# Altium project Humidity_Fan_Control_V3.PrjPcb
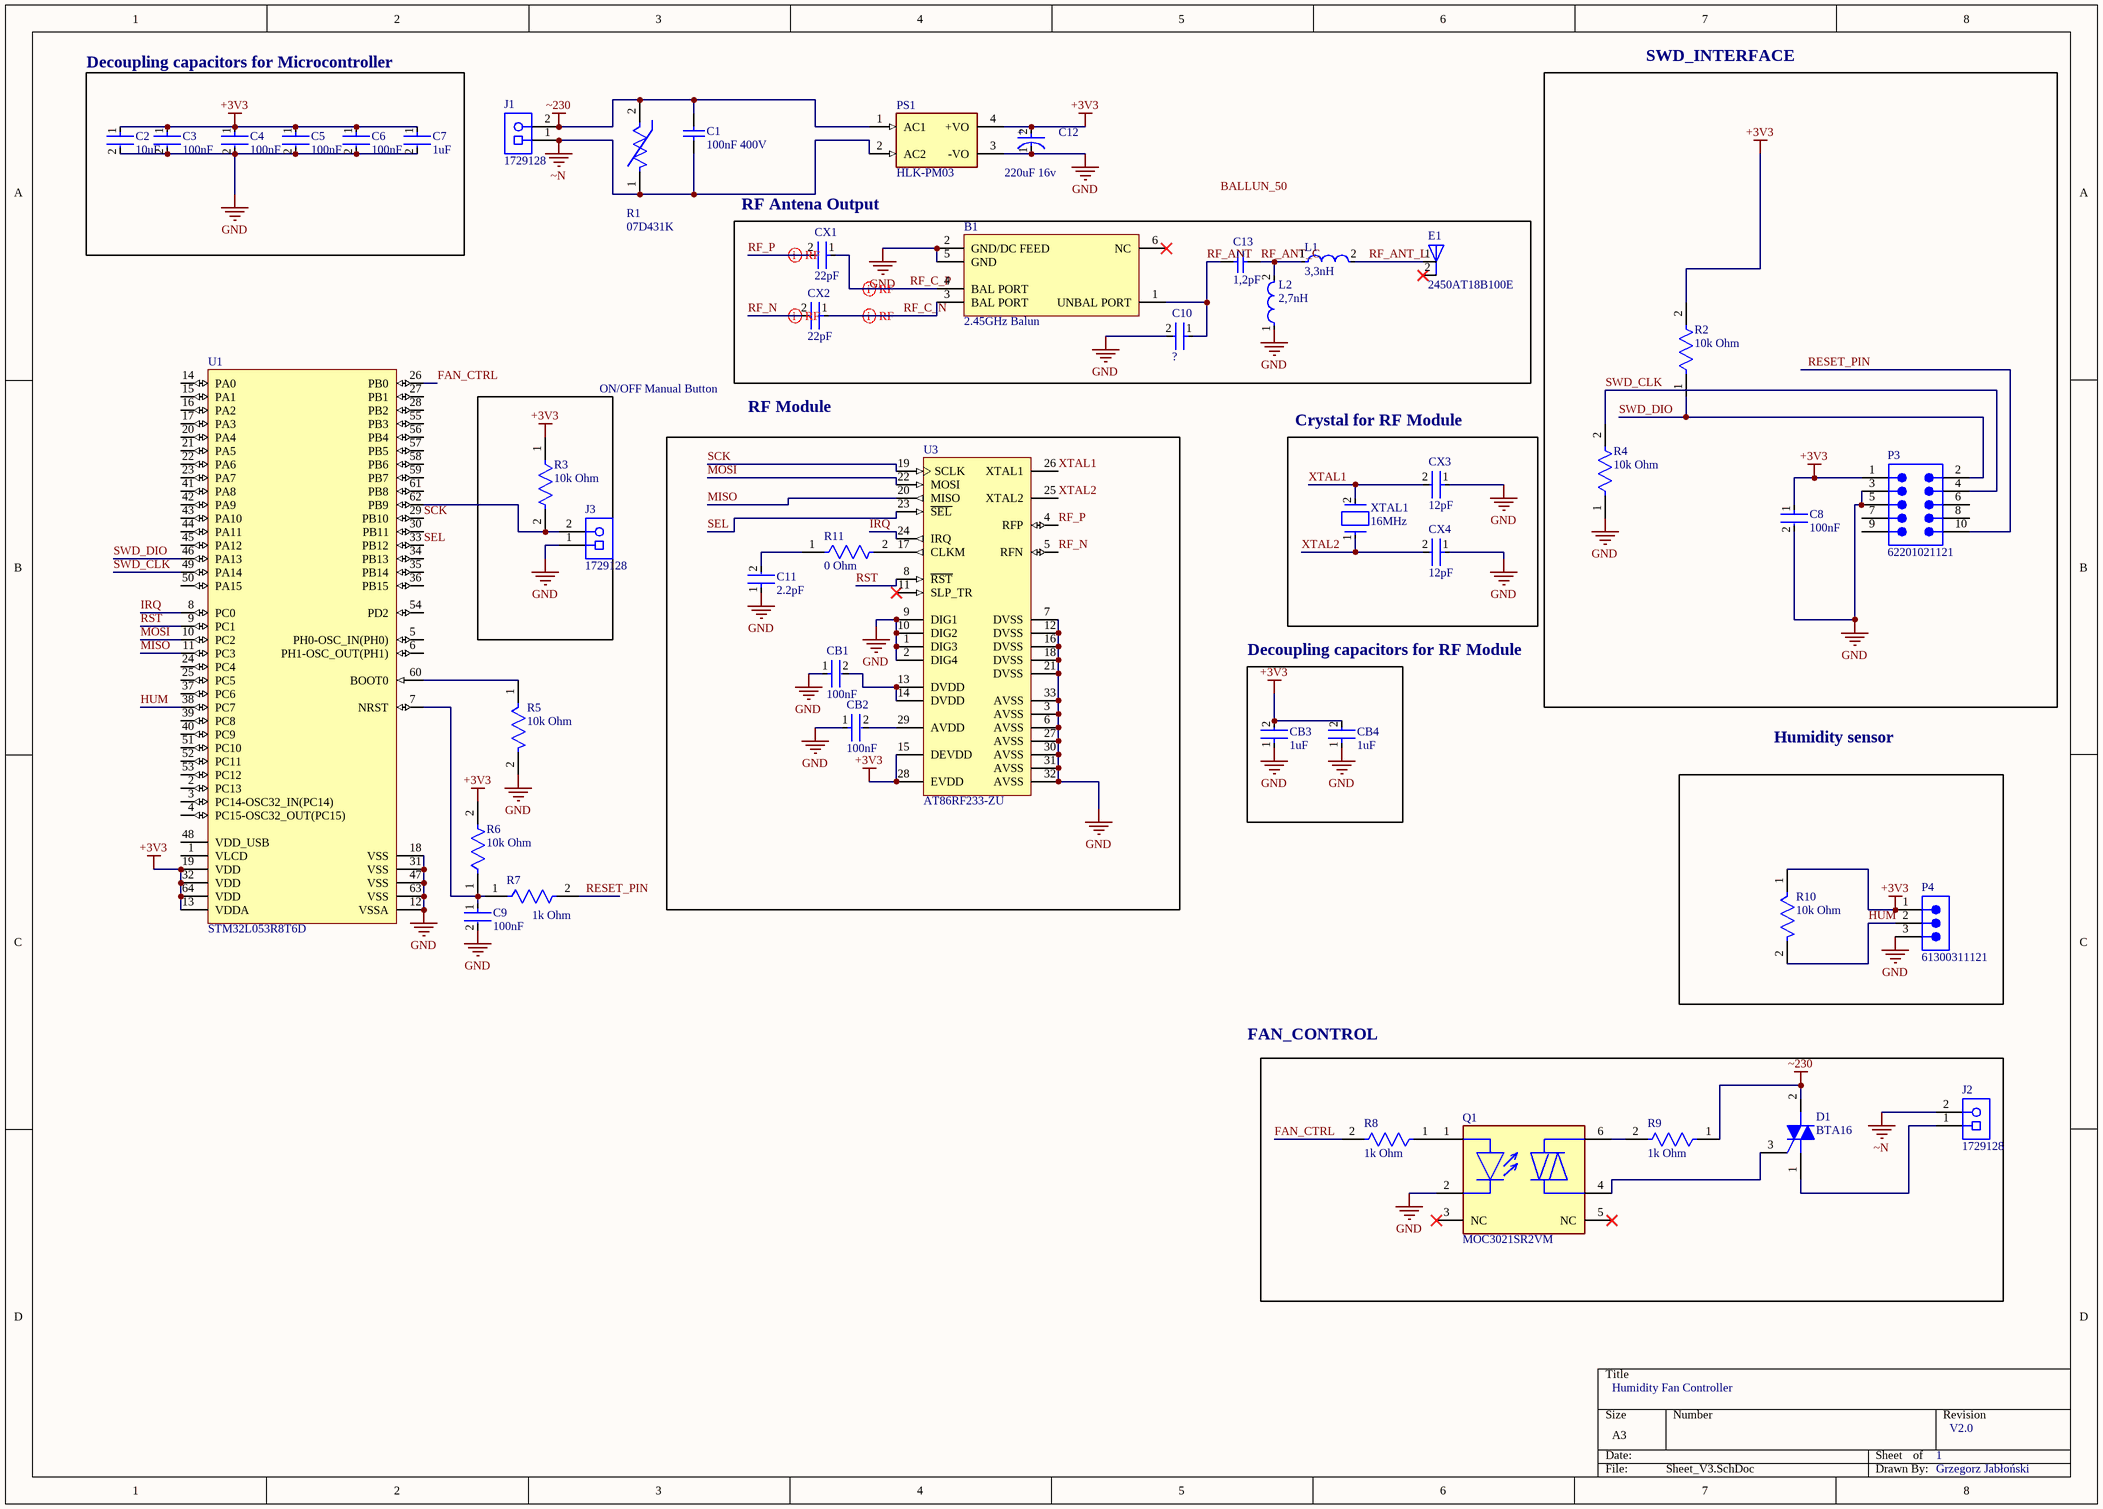
[diagram p0: Sheet_V3.SchDoc]
1 sheet, 47 parts. Net scope: global (net labels, ports and power ports of the same name join across sheets).
Board file: PCB_V3.PcbDoc

## Sheet Sheet_V3.SchDoc: Humidity Fan Controller
size A3; Author: Grzegorz Jabłoński; Revision: V2.0; SheetNumber: 1; SheetTotal: 1

### Parts
B1  2.45GHz Balun  [WE-BAL_0805]
C1  100nF 400V  [TDK-B32921C3104M]
C2  10uF  [FP-CC0805-0_85-MFG]
C3  100nF  [FP-CC0805-0_85-MFG]
C4  100nF  [FP-CC0805-0_85-MFG]
C5  100nF  [FP-CC0805-0_85-MFG]
C6  100nF  [FP-CC0805-0_85-MFG]
C7  1uF  [FP-CC0805-0_85-MFG]
C8  100nF  [FP-CC0805-0_85-MFG]
C9  100nF  [FP-CC0805-0_85-MFG]
C10  ?  [FP-CC0805-0_85-MFG]
C11  2.2pF  [FP-CC0805-0_85-MFG]
C12  220uF 16v  [FP-OS-CON-TH-E13-d_0_6-MFG]
C13  1,2pF  [CAPC1005X56X25NL10T15]
CB1  100nF  [FP-CC0805-0_85-MFG]
CB2  100nF  [FP-CC0805-0_85-MFG]
CB3  1uF  [FP-CC0805-0_85-MFG]
CB4  1uF  [FP-CC0805-0_85-MFG]
CX1  22pF  [FP-CC0805-0_85-MFG]
CX2  22pF  [FP-CC0805-0_85-MFG]
CX3  12pF  [FP-CC0805-0_85-MFG]
CX4  12pF  [FP-CC0805-0_85-MFG]
D1  BTA16  [ONSC-TO-220-3-221A-09]
E1  2450AT18B100E  [XDCR_2450AT18B100E]
J1  1729128  [PHOE-1729128-2_V]
J2  1729128  [PHOE-1729128-2_V]
J3  1729128  [PHOE-1729128-2_V]
L1  3,3nH  [FP-L-07-MFG]
L2  2,7nH  [FP-L-07-MFG]
P3  62201021121  [62201021121]
P4  61300311121  [61300311121]
PS1  HLK-PM03  [CONV_HLK-PM03]
Q1  MOC3021SR2VM  [FP-646BY-MFG]
R1  07D431K  [FP-B72207S0110K101-MFG]
R2  10k Ohm  [FP-RMCF0805-MFG]
R3  10k Ohm  [FP-RMCF0805-MFG]
R4  10k Ohm  [FP-RMCF0805-MFG]
R5  10k Ohm  [FP-RMCF0805-MFG]
R6  10k Ohm  [FP-RMCF0805-MFG]
R7  1k Ohm  [FP-RMCF0805-MFG]
R8  1k Ohm  [FP-RMCF0805-MFG]
R9  1k Ohm  [FP-RMCF0805-MFG]
R10  10k Ohm  [FP-RMCF0805-MFG]
R11  0 Ohm  [FP-RMCF0805-MFG]
U1  STM32L053R8T6D  [STM-LQFP64_L]
U3  AT86RF233-ZU  [32QN2_M]
XTAL1  16MHz  [FP-ABLS-MFG]

### Blocks framed on the sheet
Decoupling capacitors for Microcontroller: C2-C7
SWD_INTERFACE: C8 P3 R2 R4
RF Antena Output: B1 C10 C13 CX1 CX2 E1 L1 L2
ON/OFF Manual Button: J3 R3
Crystal for RF Module: CX3 CX4 XTAL1
Decoupling capacitors for RF Module: CB3 CB4

### Nets
+3V3: C2.1 C3.1 C4.1 C5.1 C6.1 C7.1 C8.1 C12.2(A) CB3.2 CB4.2 P3.1 P4.1 PS1.4(+VO) R2.2 R3.1 R6.2 R10.1 U1.13(VDDA) U1.19(VDD) U1.32(VDD) U1.64(VDD) U3.15(DEVDD) U3.28(EVDD)
GND: B1.2(GND/DC_FEED) B1.5(GND) C2.2 C3.2 C4.2 C5.2 C6.2 C7.2 C8.2 C9.2 C10.2 C11.1 C12.1(C) CB1.1 CB2.1 CB3.1 CB4.1 CX3.1 CX4.1 J3.1 L2.1 P3.3 P3.5 P4.3 PS1.3(-VO) Q1.2(C) R4.1 R5.2 U1.12(VSSA) U1.18(VSS) U1.31(VSS) U1.47(VSS) U1.63(VSS) U3.1(DIG3) U3.2(DIG4) U3.3(AVSS) U3.6(AVSS) U3.7(DVSS) U3.9(DIG1) U3.10(DIG2) U3.12(DVSS) U3.16(DVSS) U3.18(DVSS) U3.21(DVSS) U3.27(AVSS) U3.30(AVSS) U3.31(AVSS) U3.32(AVSS) U3.33(AVSS)
~230: C1.2 D1.2(MT2) J1.2 PS1.1(AC1) R1.2 R9.1
~N: C1.1 J1.1 J2.2 PS1.2(AC2) R1.1
FAN_CTRL: R8.2 U1.26(PB0)
HUM: P4.2 R10.2 U1.38(PC7)
IRQ: U1.8(PC0) U3.24(IRQ)
MISO: U1.11(PC3) U3.20(MISO)
MOSI: U1.10(PC2) U3.22(MOSI)
RESET_PIN: P3.10 R7.2
RF_ANT: B1.1(UNBAL_PORT) C10.1 C13.1
RF_ANT_C: C13.2 L1.1 L2.2
RF_ANT_L: E1.1(FEED) L1.2
RF_C_N: B1.3(BAL_PORT) CX2.1
RF_C_P: B1.4(BAL_PORT) CX1.1
RF_N: CX2.2 U3.5(RFN)
RF_P: CX1.2 U3.4(RFP)
RST: U1.9(PC1) U3.8(~{RST})
SCK: U1.29(PB10) U3.19(SCLK)
SEL: U1.33(PB12) U3.23(~{SEL})
SWD_CLK: P3.4 R4.2 U1.49(PA14)
SWD_DIO: P3.2 R2.1 U1.46(PA13)
XTAL1: CX3.2 U3.26(XTAL1) XTAL1.2
XTAL2: CX4.2 U3.25(XTAL2) XTAL1.1
NetC9_1: C9.1 R6.1 R7.1 U1.7(NRST)
NetC11_2: C11.2 R11.1
NetCB1_2: CB1.2 U3.13(DVDD) U3.14(DVDD)
NetCB2_2: CB2.2 U3.29(AVDD)
NetD1_1: D1.1(MT1) J2.1
NetD1_3: D1.3(G) Q1.4(1_MAIN_TERM)
NetJ3_2: J3.2 R3.2 U1.62(PB9)
NetQ1_1: Q1.1(A) R8.1
NetQ1_6: Q1.6(2_MAIN_TERM) R9.2
NetR5_1: R5.1 U1.60(BOOT0)
NetR11_2: R11.2 U3.17(CLKM)

Not connected (* = marked no-connect by the designer): B1 6(NC)*; E1 2(NC)*; P3 6 7 8 9; Q1 3(NC)* 5(NC)*; U1 1(VLCD) 2(PC13) 3(PC14-OSC32_IN(PC14)) 4(PC15-OSC32_OUT(PC15)) 5(PH0-OSC_IN(PH0)) 6(PH1-OSC_OUT(PH1)) 14(PA0) 15(PA1) 16(PA2) 17(PA3) 20(PA4) 21(PA5) 22(PA6) 23(PA7) 24(PC4) 25(PC5) 27(PB1) 28(PB2) 30(PB11) 34(PB13) 35(PB14) 36(PB15) 37(PC6) 39(PC8) 40(PC9) 41(PA8) 42(PA9) 43(PA10) 44(PA11) 45(PA12) 48(VDD_USB) 50(PA15) 51(PC10) 52(PC11) 53(PC12) 54(PD2) 55(PB3) 56(PB4) 57(PB5) 58(PB6) 59(PB7) 61(PB8); U3 11(SLP_TR)*

### Layout directives
differential pair; differential pair class RF: RF_C_N, RF_C_P, RF_N, RF_P

### Notes on the sheet
- RF Module
- Humidity sensor
- FAN_CONTROL
- Labels drawn without touching a wire or pin: BALLUN_50
- (in symbol CMP-05428-000279-1) +

### Library data of the parts
B1 = CMP-03913-19122360-1: 748421245 100O Surface Mount Chip Balun; Insertion Loss (dB): 0.54dB; Impedance: 100Ω; Frequency: 2.5GHz; Depth: 850µm; Case Code (Metric): 2012; Height: 850µm; Max Operating Temperature: 85°C; Length: 2mm; Width: 1.25mm; Termination: SMD/SMT; Case Code (Imperial): 0805; Number of Pins: 6; RoHS: Compliant; Max Switching Frequency: 2.5GHz; NexarPartId: 19122360; REACH SVHC: Unknown; Case/Package: 0805; Min Operating Temperature: -40°C; Lead Free: Lead Free; Mount: Surface Mount; Max Frequency: 2.5GHz; Packaging: Cut Tape (CT)
C1 = CMP-2000-05890-1: EMI Suppression Capacitor (MKP), 0.1 uF, +/- 20%, 305 V, 2-Pin THD, RoHS, Bulk; Manufacturer: TDK; PCN Packaging: MKT,MKPTypeLaserMarking26/Apr/2013; Online Catalog: B32921C/D-B32928C/DSeries; Featured Product: FilmCapacitors; Product Training Modules: FilmCapacitorsCapacitorsforLEDApplicationsAutomotiveIndustryCapacitors; Catalog Drawings: Y(1,2),X(1,2)SeriesSide1Y(1,2),X(1,2)SeriesSide2; PCN Design/Specification: B32(5679)B333Series02/May/2014; Other Names: 495-2318B32921C3104M000B32921C3104MN1; Capacitance: 0.1µF; Voltage Rating - AC: 305V; Dielectric Material: Polypropylene(PP); Datasheet URL: https://en.tdk.eu/inf/20/20/db/fc_2009/X2_B32921_928.pdf; Package / Case: Radial; Operating Temperature: -40°C~110°C; Lead Spacing: 0.394"(10.00mm); Size / Dimension: 0.512"Lx0.236"W(13.00mmx6.00mm); Package Reference: B32921C3104M; Datasheet Version: 09/2016; Features: X2SafetyRated; Standard Package: 1,000; Category: Capacitors; Package Description: 2-Pin Through Hole Device, Body 13 x 6 mm, Pitch 10 mm; Family: FilmCapacitors; ESR (Equivalent Series Resistance): -; Voltage Rating - DC: -; Termination: PCPins; Packaging: Bulk; Mounting Type: ThroughHole; Height - Seated (Max): 0.472"(12.00mm); Mounting Technology: ThroughHole; Manufacturer URL: http://www.tdk.com/; Applications: EMI,RFISuppression; Tolerance: ±20%; Series: B32921
C2 C7 C10 C11 = CMP-2100-03606-3: CAP CER 0.1UF 50V X7R 0805; Manufacturer Part Number: CC0805KRX7R9BB104; Manufacturer: Yageo; Tolerance: 0.1; Capacitance: 100 nF; Value: 100 nF; Material: Ceramic; Device Class L1: Passive Components; ComponentLink2Description: Datasheet; Package: CC0805-0.85; Digikey Description: CAP CER 0.1UF 50V X7R 0805; Device Class L3: Ceramic Capacitors; Temperature: -30°C to +85°C; Temperature Characteristic: X7R; Voltage Rating: 50 V; Height: 0.95mm; RoHS: TRUE; Ipc Land Pattern Name: CAPC200125X85; Device Class L2: Capacitors; Category: Cap; Temperature Range Low: -30°C; Temperature Range High: +85°C; Mouser Description: Multilayer Ceramic Capacitors MLCC - SMD/SMT 100nF 50V X7R 10%; Footprint Url: http://www.yageo.com/exep/pages/download/literatures/UPY-C_GEN_24.pdf; Automotive: No; Octopart: https://octopart.com/cc0805krx7r9bb104-yageo-192993; Lead Free: Yes; ComponentLink2URL: http://www.yageo.com/documents/recent/UPY-GPHC_Y5V_6.3V-to-50V_8.pdf
C3-C6 C8 C9 = CMP-2100-03606-3: CAP CER 0.1UF 50V X7R 0805; Manufacturer Part Number: CC0805KRX7R9BB104; Manufacturer: Yageo; Tolerance: 0.1; Material: Ceramic; Device Class L1: Passive Components; ComponentLink2Description: Datasheet; Package: CC0805-0.85; Digikey Description: CAP CER 0.1UF 50V X7R 0805; Capacitance: 100 nF; Device Class L3: Ceramic Capacitors; Value: 100 nF; Temperature: -30°C to +85°C; Temperature Characteristic: X7R; Voltage Rating: 50 V; Height: 0.95mm; RoHS: TRUE; Ipc Land Pattern Name: CAPC200125X85; Device Class L2: Capacitors; Category: Cap; Temperature Range Low: -30°C; Temperature Range High: +85°C; Mouser Description: Multilayer Ceramic Capacitors MLCC - SMD/SMT 100nF 50V X7R 10%; Footprint Url: http://www.yageo.com/exep/pages/download/literatures/UPY-C_GEN_24.pdf; Automotive: No; Octopart: https://octopart.com/cc0805krx7r9bb104-yageo-192993; Lead Free: Yes; ComponentLink2URL: http://www.yageo.com/documents/recent/UPY-GPHC_Y5V_6.3V-to-50V_8.pdf
C12 = CMP-05428-000279-1: Conductive Polymer Aluminum Solid Capacitors (OS-CON) 560uF ±20% 16V RADIAL TH 8x13mm; ESR (Equivalent Series Resistance): 8mR; Case/Package: Radial; Tolerance: 20%; Min Operating Temperature: -55°C; Max Operating Temperature: 105°C; Packaging: Bulk; Series: OS-CON™, SEPG; Mount: Through Hole; Capacitance: 560uF; RoHS Compliant: Yes; Voltage Rating: 16V
C13 = CMP-2008-02540-1: Manufacturer: AVX Interconnect / Elco; Part Number: 04023C561KAT2A
CB1 CB2 = CMP-2100-03606-3: CAP CER 0.1UF 50V X7R 0805; Manufacturer Part Number: CC0805KRX7R9BB104; Manufacturer: Yageo; Tolerance: 0.1; Device Class L1: Passive Components; ComponentLink2Description: Datasheet; Package: CC0805-0.85; Digikey Description: CAP CER 0.1UF 50V X7R 0805; Capacitance: 100 nF; Device Class L3: Ceramic Capacitors; Value: 100 nF; Temperature: -30°C to +85°C; Temperature Characteristic: X7R; Voltage Rating: 50 V; Height: 0.95mm; RoHS: TRUE; Ipc Land Pattern Name: CAPC200125X85; Device Class L2: Capacitors; Category: Cap; Temperature Range Low: -30°C; Temperature Range High: +85°C; Material: Ceramic; Mouser Description: Multilayer Ceramic Capacitors MLCC - SMD/SMT 100nF 50V X7R 10%; Footprint Url: http://www.yageo.com/exep/pages/download/literatures/UPY-C_GEN_24.pdf; Automotive: No; Octopart: https://octopart.com/cc0805krx7r9bb104-yageo-192993; Lead Free: Yes; ComponentLink2URL: http://www.yageo.com/documents/recent/UPY-GPHC_Y5V_6.3V-to-50V_8.pdf
CB3 CB4 CX1-CX4 = CMP-2100-03606-3: CAP CER 0.1UF 50V X7R 0805; Manufacturer Part Number: CC0805KRX7R9BB104; Manufacturer: Yageo; Tolerance: 0.1; Capacitance: 100 nF; Value: 100 nF; Device Class L1: Passive Components; ComponentLink2Description: Datasheet; Package: CC0805-0.85; Digikey Description: CAP CER 0.1UF 50V X7R 0805; Device Class L3: Ceramic Capacitors; Temperature: -30°C to +85°C; Temperature Characteristic: X7R; Voltage Rating: 50 V; Height: 0.95mm; RoHS: TRUE; Ipc Land Pattern Name: CAPC200125X85; Device Class L2: Capacitors; Category: Cap; Temperature Range Low: -30°C; Temperature Range High: +85°C; Material: Ceramic; Mouser Description: Multilayer Ceramic Capacitors MLCC - SMD/SMT 100nF 50V X7R 10%; Footprint Url: http://www.yageo.com/exep/pages/download/literatures/UPY-C_GEN_24.pdf; Automotive: No; Octopart: https://octopart.com/cc0805krx7r9bb104-yageo-192993; Lead Free: Yes; ComponentLink2URL: http://www.yageo.com/documents/recent/UPY-GPHC_Y5V_6.3V-to-50V_8.pdf
D1 = CMP-1070-00099-1: Sensitive Gate Triacs, Silicon Bidirectional Thyristor, 3-Pin TO-220, Pb-Free, Bulk Box; PartNumber: MAC228A6G; Manufacturer: On Semiconductor; ITSM Max (A): 80; IT(RMS) Max (A): 8; DatasheetVersion: Rev. 7; ComponentLink2Description: Datasheet; PackageDescription: 3-Pin Flange Mount, Vertical Straight Lead, Body 9.97 x 4.445 mm, Pitch 2.54 mm; Packing: Bulk Box; ComponentLink3Description: Package Specification; RoHS: Pb-Free; ComponentLink2URL: http://www.onsemi.com/pub_link/Collateral/MAC228A-D.PDF; ComponentLink3URL: http://www.onsemi.com/pub_link/Collateral/221A-09.PDF; ComponentLink1URL: http://www.onsemi.com/; PackageVersion: Rev. AG, 09/2011; PackageReference: TO-220-3-221A-09; ComponentLink1Description: Manufacturer URL; Mounting Technology: Through Hole
E1 = 2450AT18B100E: 2.4GHz - Chip RF Antenna 2.4GHz ~ 2.5GHz 0.5dBi Solder Surface Mount; MF: Johanson Technology; Price: None; Package: None; Purchase-URL: https://pricing.snapeda.com/search/part/2450AT18B100E/?ref=eda; MP: 2450AT18B100E; Availability: In Stock; SnapEDA_Link: https://www.snapeda.com/parts/2450AT18B100E/Johanson+Technology+Inc./view-part/?ref=snap; Check_prices: https://www.snapeda.com/parts/2450AT18B100E/Johanson+Technology+Inc./view-part/?ref=eda; Value: *
J1-J3 = CMP-2000-05815-1: PCB Terminal Block, 13.5 A, 400 V, 2-Pin THD, RoHS, Bulk; Manufacturer: Phoenix Contact; Package Version: 03/2015; No. of Rows: 1; Pitch: 5.08mm; No. of Positions: 2; Voltage Rating: 400V; Current Rating: 13500mA; Manufacturer URL: http://www.phoenixcontact.com/; Datasheet URL: https://datasheet.ciiva.com/16046/1729128-16046181.pdf; RoHS: TRUE; Package URL: https://www.phoenixcontact.com/online/portal/pi/pxc/product_detail_page/!ut/p/b1/3VdJjqNKFDxLH8AFycySyWY2ozFsEPOMMQaDOX1XedGL_1Vdm5YXJleknhSKeBkvI6EA8ncAo3AYoDhBQGco6KN7VURTdemj9us_IEKEZo_YHiPAEWEFmDGOHMORkqKYCORBZxgL7ZoaZYcbFFUZ3fqxSY6GOuxydWUuHqz1ynmMFygu583Bob0Ewr6Sd_l-5m-kAueHiB0jpRwZwe58wwtkpxtMYd_LmGcDRU02dRNEyWt6Y2ti5pSyJ_reIkzIulrqApdnbT11V5jnCKbYNCvhEM1MCpPByat_X379-iThf08CI5GfOPqfBeS3BRoBOdD55AKVv0iLwCMq-2BrzXWSGRH7pUGD9uwXQjiph3xL0DKQwdGa0JImiIOmBNOestqgwTHSSs2oOep-78apyXQBvNi8ZLaFjvjWvcaUEBu0MC6Wbe-d6mB0FAebo2lUWinqYaZs5DAYzV0RP9yitUjnGJ0iI9xhZkT42OCQNUJJhkgWINNQLP2JFP6OpMg3JCVg70jqHT0lvKOnhHf0lPuOnnLf0VPuWx6_dxwUIvwk5WMkT0kLL1mh61l2yZVSzG3pYV_bqo-mj6uMKwKwdnnW8Jh5RTOJzMOA5c-eJDaZQw4mTMPH02PvS_ZAqNVjVTo2WyYLkwH_KU1mmmG5kjRhDqPXLwwVHvVOjCM60-fpXvTDfMGW1PVFVS1r4e4yVDk4ZdNbkUHvqPqQSeian4UD39fNKmachqdJ1NJbyk8rXT9mXTvPk3oE5meulKGgiruPJek-4I9hTT6G8ZLOyRSm2RRVbThERQad5OS28hdt4YW4vG0stgYYzsWsK4_7y6DZMjJSCqri1kyiZR5vD7pwIrNR7QwPHTcLTI5qT7eRlpHrdGiupYlqQDJ7zy_CND8fWWBoLRXxk1RVcXiBQwbTD4Xi7KL-FuO94t9xaqweXzH; PartNumber: 1729128; Package Description: 2-Pin Through Hole Device, Body 8.1 x 10.16 mm, Pitch 5.08 mm; Datasheet Version: 12/2013; Mounting Technology: ThroughHole; Orientation: Horizontal; Package Reference: 1729128-2; Packing: Bulk
L1 L2 = CMP-56493-000002-1: FIXED IND 3.3NH 300MA 190MOHM SM; Shielding: Unshielded; DC Resistance (DCR): 190mR; Core Material: Ceramic; Self Resonant Frequency: 21GHz; Q Factor: 8; Test Frequency: 100MHz; Case Code (Imperial): 0402; Termination: SMD/SMT; Height - Seated (Max): 0.024inch; Depth: 0.6mm; Width: 0.5mm; Current Rating: 300mA; Military Standard: Not; REACH SVHC: No SVHC; Number of Pins: 2; Weight: 2.3E-05oz; Package Quantity: 10000; RoHS Compliant: Yes; Case/Package: 0402; Min Operating Temperature: -40°C; Mount: Surface Mount; Case Code (Metric): 1005; Radiation Hardening: No; Height: 0.5mm; Max Operating Temperature: 100°C; Series: L-07; DC Current: 300mA; Max DC Current: 300mA; Packaging: Cut Tape; Length: 1mm; Inductance: 3.3nH
P3 = CMP-1502-00948-3: NexarPartId: 32855586; Pitch: 1.27mm; Operating Supply Voltage: 100V; Connector Type: Male Pin; Contact Resistance: 20mΩ; Current Rating: 1A; Number of Contacts: 10; Gender: Male; Contact Mating Length: 3.81mm; Max Operating Temperature: 105°C; Mount: Through Hole; Number of Pins: 10; Row Spacing: 1.27mm; Lead Pitch: 1.27mm; REACH SVHC: Unknown; Min Operating Temperature: -40°C; Contact Material: Copper; Orientation: Vertical; Contact Plating: Gold; Number of Rows: 2; RoHS: Compliant; Packaging: Box; Voltage Rating: 100V; Color: Black; Height: 5.65mm; Termination: Solder; Number of Positions: 10
P4 = CMP-1502-01062-3: NexarPartId: 32855521; Current Rating: 3A; Voltage Rating: 250V; Number of Positions: 3; Pitch: 2.54mm; Contact Resistance: 20mΩ; Connector Type: Male Pin; Gender: Male; REACH SVHC: Unknown; Packaging: Bulk; Contact Material: Copper; Min Operating Temperature: -40°C; Number of Rows: 1; Orientation: Vertical; RoHS: Compliant; Contact Plating: Gold; Max Operating Temperature: 105°C; Mount: Through Hole; Height: 8.94mm; Operating Supply Voltage: 250V; Number of Pins: 3; Contact Mating Length: 5.9944mm; Number of Contacts: 3; Color: Black; Lead Free: Lead Free; Lead Pitch: 2.54mm; Termination: Solder
PS1 = HLK-PM03: MF: Hi-link; SnapEDA_Link: https://www.snapeda.com/parts/HLK-PM03/Hi-link/view-part/?ref=snap; Package: None; Value: *; MP: HLK-PM03; Check_prices: https://www.snapeda.com/parts/HLK-PM03/Hi-link/view-part/?ref=eda
Q1 = CMP-00278-84330366-1: MOC3021SR2VM Triac Driver Output Optocoupler, 6-Pin DIP 400V Random Phase; Manufacturer Lifecycle Status: ACTIVE; Isolation Voltage: 7.5kV; Power Dissipation: 330mW; Hold Current: 100µA; Number of Circuits: 1; Approvals: EN, IEC, UL; Input Current: 60mA; Nominal Input Voltage: 1.15V; Reverse Breakdown Voltage: 3V; Max Input Voltage: 1.5V; Max Operating Temperature: 85°C; Weight: 810mg; Mount: Surface Mount; REACH SVHC: No SVHC; Case/Package: SMD/SMT; NexarPartId: 84330366; RoHS: Compliant; Lead Free: Lead Free; Schedule B: 8541408000, 8541408000; Number of Elements: 1; Number of Channels: 1; Packaging: Digi-Reel®; Forward Voltage: 1.15V; Forward Current: 60mA; Number of Pins: 6; Radiation Hardening: No; Output Voltage: 400V; Max Power Dissipation: 330mW; Lifecycle Status: Production; Min Operating Temperature: -40°C
R1 = CMP-10618-000012-1: VARISTOR 18V 250A DISC 7MM; Manufacturer: EPCOS; Manufacturer Part Number: B72207S0110K101; Voltage Rating Ac: 11V; Voltage Rating Dc: 14V; Clamping Voltage: 36V; Capacitance: 2750pF; Clamping Current: 2.5A; Value: 2750pF; Voltage Tolerance: 10%; ComponentLink2URL: https://product.tdk.com/info/en/documents/data_sheet/70/db/var/SIOV_Leaded_StandarD.pdf; Device Class L2: Varistors; Temperature: -40°C to +105°C; ComponentLink2Description: Datasheet; Device Class L3: unset; Lead Free: Yes; Package: B72207S0110K101; Automotive: No; Height: 11mm; Temperature Range Low: -40°C; RoHS: TRUE; Device Class L1: Circuit Protection; Varistor Voltage: 18V; Temperature Range High: +105°C; Octopart: https://octopart.com/b72207s0110k101-epcos-11931358; Category: Res; Mouser Description: Varistor: metal-oxide; THT; 11VAC; 14VDC; 18V; 250A; 800mJ; Digikey Description: VARISTOR 18V 250A DISC 7MM
R2-R11 = CMP-26527-000017-1: RES 0 OHM JUMPER 1/8W 0805; Power Rating: 125mW; Resistance: 0mR; Depth: 1.25mm; Length: 2mm; Military Standard: Not; Width: 0.049inch; Case Code (Imperial): 0805; Number of Terminations: 2; Mount: Surface Mount; Contact Plating: Tin; Height: 0.026inch; Case/Package: 0805; Min Operating Temperature: -55°C; Composition: Thick Film; Max Operating Temperature: 155°C; Packaging: Tape and Reel; Features: Automotive AEC-Q200; Max Power Dissipation: 125mW; Radiation Hardening: No; Lead Free: Lead Free; Case Code (Metric): 2012
U1 = CMP-1546-00063-2: Ultra-low-power 32-Bit MCU ARM-based Cortex-M0+, 64 KB Flash, 8 KB RAM, 51 I/Os, 64-Pin LQFP, -40 to 85 degC, Tray; I/Os (High Current): 51; Core: ARM Cortex-M0+; FLASH Size (Prog) (kB): 64; Internal RAM Size (kB): 8; D/A Converter: 1; Operating Frequency(F) (Processor speed) (MHz): 32; Supply Voltage(Vcc) min (V): 1.65; Data E2PROM nom (B): 2048; Package Description: 64-Pin Low-profile Quad Flat Package, Body 10 x 10 mm, Pitch 0.5 mm; ComponentLink2URL: http://www.st.com/st-web-ui/static/active/en/resource/technical/document/datasheet/DM00105960.pdf; Package Reference: LQFP64; ComponentLink1URL: http://www.st.com/; Packing: Tray; ComponentLink1Description: Manufacturer URL; ComponentLink2Description: Datasheet; DatasheetVersion: Rev. 5; Mounting Technology: Surface Mount
U3 = CMP-0295-00009-1: Low Power, 2.4GHz Transceiver for ZigBee, RF4CE, IEEE 802.15.4, 6LoWPAN, and ISM Application, 1.8 to 3.6 V, -40 to 85 degC, 32-Pin VQFN (QN2), RoHS, Tray; Manufacturer: Atmel; Frequency Band: 2445 MHz Typ.; Data Rate: 2 Mb/s Max.; Power Output: 4 dBm Typ.; PackageVersion: Rev. A; ComponentLink3URL: http://www.atmel.com/Images/Atmel-8351-MCU_Wireless-AT86RF233_Datasheet.pdf; Temperature Range: -40 to 85 degC; DatasheetVersion: Rev. 8315E; ComponentLink1Description: Manufacturer URL; ComponentLink2Description: Datasheet; ComponentLink3Description: Package Specification; Mounting Technology: Surface Mount; RoHS: TRUE; ComponentLink1URL: www.atmel.com/; PartNumber: AT86RF233-ZU; ComponentLink2URL: http://www.atmel.com/Images/Atmel-8351-MCU_Wireless-AT86RF233_Datasheet.pdf; Voltage Range: 1.8 to 3.6 V; PackageDescription: 32-Pin Quad Flat Non-Leaded Package, Body 5 x 5 mm, Pitch 0.5 mm; Packing: Tray
XTAL1 = CMP-27762-000003-1: CRYSTAL 16.0000MHZ 18PF SMD; Manufacturer Part Number: ABLS-16.000MHZ-K4T; Manufacturer: Abracon; Stability: 50ppm; Tolerance: 30ppm; Standoff Height: 0mm; Esr: 40Ω; ComponentLink2URL: https://abracon.com/Resonators/abls.pdf; Frequency: 16MHz; Temperature Range High: +125°C; Package: ABLS; Device Class L3: Crystals; Temperature: -40°C to +125°C; Load Capacitance: 18pF; Device Class L2: Crystals / Oscillators; Mouser Description: Crystal 16MHz ±30ppm (Tol) ±50ppm (Stability) 18pF FUND 40Ohm 2-Pin HC-49/US SMD T/R; Category: Crys; ComponentLink2Description: Datasheet; Series: ABLS; Automotive: No; Octopart: https://octopart.com/abls-16.000mhz-k4t-abracon-18618626; RoHS: TRUE; Digikey Description: CRYSTAL 16.0000MHZ 18PF SMD; Temperature Range Low: -40°C; Lead Free: Yes; Height: 4.3mm; Device Class L1: Passive Components